# Altium schematic sheet Connectors.SchDoc: Connectors
size A3; Date: Not used; ApprovedBy: Not used; CheckedBy: Not used; Author: Not used; CompanyName: STMicroelectronics; DrawnBy: Not used; Engineer: Not used; Organization: Not used; Address1: Not used; Address2: Not used; Address3: Not used; Address4: Not used; DocumentNumber: 5; Revision: Not used; SheetNumber: 5; SheetTotal: 9; CurrentTime: Not used; CurrentDate: Not used; Time: Not used; DocumentFullPathAndName: Not used; DocumentName: Not used; ModifiedDate: Not used; ImagePath: Not used; ProjectName: Not used; Application_BuildNumber: Not used
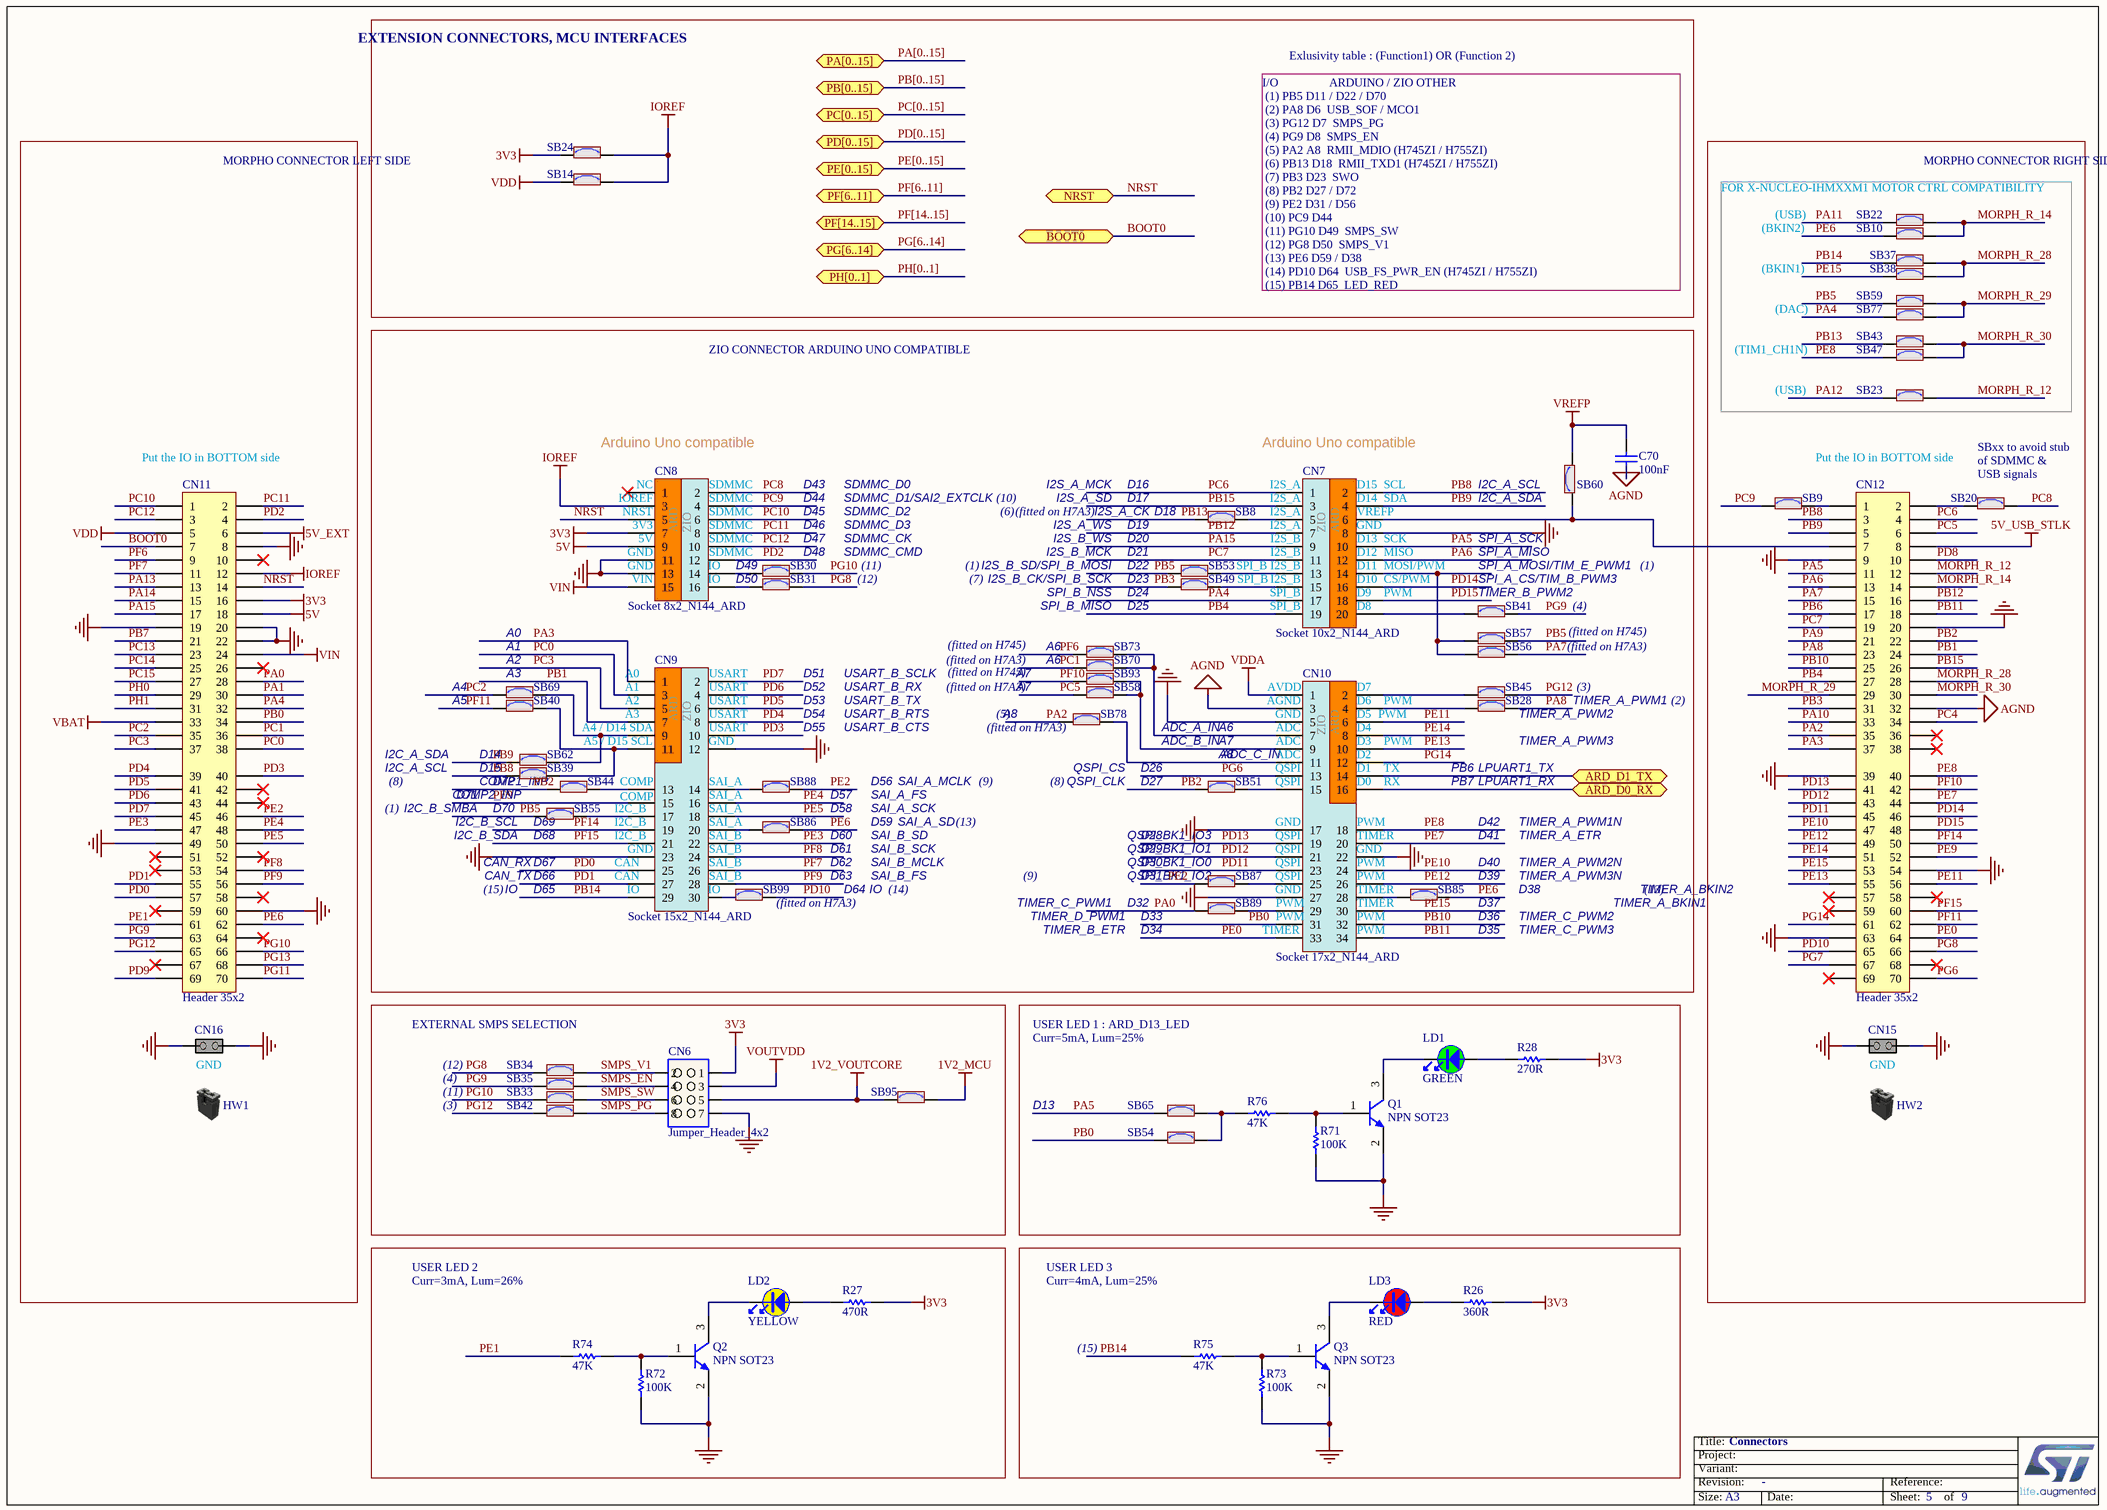
[diagram p0: Connectors.SchDoc]

## Parts
C70  value 100nF  [C0603]  (hidden comment: Capacitor)
CN6  value Jumper_Header_4x2  [CON_SAMTEC_TSW-104-07-X-D]  (hidden comment: Jumper_Header 4x2)
CN7  Socket 10x2_N144_ARD  [CON_SAMTEC_SSW-110-23-X-D_N144_ARD]
CN8  Socket 8x2_N144_ARD  [CON_SAMTEC_SSW-108-23-X-D_N144_ARD]
CN9  Socket 15x2_N144_ARD  [CON_SAMTEC_SSW-115-23-X-D_N144_ARD]
CN10  Socket 17x2_N144_ARD  [CON_SAMTEC_SSW-117-23-X-D_N144_ARD]
CN11  Header 35x2  [CON_SAMTEC_TSW-135-07-X-D]
CN12  Header 35x2  [CON_SAMTEC_TSW-135-07-X-D]
CN15  Jumper_Header 2x1  [CON_SAMTEC_TSW-102-09-X-S]  (value not drawn)
CN16  Jumper_Header 2x1  [CON_SAMTEC_TSW-102-09-X-S]  (value not drawn)
HW1  Shunt Black 2.54mm  (value not drawn)  (mechanical)
HW2  Shunt Black 2.54mm  (value not drawn)  (mechanical)
LD1  value GREEN  [LED_0603_OSRAM_LG-Q396-PS-35_GREEN_1A2K_H0P4]  (hidden comment: LED_green)
LD2  value YELLOW  [LED_0603_OSRAM_LY-Q396-P1Q2-36_YELLOW_1A2K_H0P4]  (hidden comment: LED_yellow)
LD3  value RED  [LED_0603_OSRAM_LS-Q976-NR-1_RED_1A2K_H0P8]  (hidden comment: LED_red)
Q1  value NPN SOT23  [NPN_SOT23]  (hidden comment: 9013-SOT23)
Q2  value NPN SOT23  [NPN_SOT23]  (hidden comment: 9013-SOT23)
Q3  value NPN SOT23  [NPN_SOT23]  (hidden comment: 9013-SOT23)
R26  value 360R  [R0603]  (hidden comment: Resistor)
R27  value 470R  [R0603]  (hidden comment: Resistor)
R28  value 270R  [R0402]  (hidden comment: Resistor)
R71  value 100K  [R0603]  (hidden comment: Resistor)
R72  value 100K  [R0603]  (hidden comment: Resistor)
R73  value 100K  [R0603]  (hidden comment: Resistor)
R74  value 47K  [R0603]  (hidden comment: Resistor)
R75  value 47K  [R0603]  (hidden comment: Resistor)
R76  value 47K  [R0603]  (hidden comment: Resistor)
SB8  SB_ON  [SOLDER-BRIDGE_R0603-0R]  (value not drawn)
SB9  SB_ON  [SOLDER-BRIDGE_R0603-0R]  (value not drawn)
SB10  SB_ON  [SOLDER-BRIDGE_R0603-0R]  (value not drawn)
SB14  SB_ON  [SOLDER-BRIDGE_R0402-0R]  (value not drawn)
SB20  SB_ON  [SOLDER-BRIDGE_R0603-0R]  (value not drawn)
SB22  SB_ON  [SOLDER-BRIDGE_R0603-0R]  (value not drawn)
SB23  SB_ON  [SOLDER-BRIDGE_R0603-0R]  (value not drawn)
SB24  SB_ON  [SOLDER-BRIDGE_R0402-0R]  (value not drawn)
SB28  SB_ON  [SOLDER-BRIDGE_R0603-0R]  (value not drawn)
SB30  SB_ON  [SOLDER-BRIDGE_R0603-0R]  (value not drawn)
SB31  SB_ON  [SOLDER-BRIDGE_R0603-0R]  (value not drawn)
SB33  SB_ON  [SOLDER-BRIDGE_R0603-0R]  (value not drawn)
SB34  SB_ON  [SOLDER-BRIDGE_R0603-0R]  (value not drawn)
SB35  SB_ON  [SOLDER-BRIDGE_R0603-0R]  (value not drawn)
SB37  SB_ON  [SOLDER-BRIDGE_R0402-0R]  (value not drawn)
SB38  SB_ON  [SOLDER-BRIDGE_R0402-0R]  (value not drawn)
SB39  SB_ON  [SOLDER-BRIDGE_R0603-0R]  (value not drawn)
SB40  SB_ON  [SOLDER-BRIDGE_R0603-0R]  (value not drawn)
SB41  SB_ON  [SOLDER-BRIDGE_R0603-0R]  (value not drawn)
SB42  SB_ON  [SOLDER-BRIDGE_R0603-0R]  (value not drawn)
SB43  SB_ON  [SOLDER-BRIDGE_R0603-0R]  (value not drawn)
SB44  SB_ON  [SOLDER-BRIDGE_R0603-0R]  (value not drawn)
SB45  SB_ON  [SOLDER-BRIDGE_R0603-0R]  (value not drawn)
SB47  SB_ON  [SOLDER-BRIDGE_R0603-0R]  (value not drawn)
SB49  SB_ON  [SOLDER-BRIDGE_R0603-0R]  (value not drawn)
SB51  SB_ON  [SOLDER-BRIDGE_R0603-0R]  (value not drawn)
SB53  SB_ON  [SOLDER-BRIDGE_R0603-0R]  (value not drawn)
SB54  SB_ON  [SOLDER-BRIDGE_R0603-0R]  (value not drawn)
SB55  SB_ON  [SOLDER-BRIDGE_R0603-0R]  (value not drawn)
SB56  SB_ON  [SOLDER-BRIDGE_R0603-0R]  (value not drawn)
SB57  SB_ON  [SOLDER-BRIDGE_R0603-0R]  (value not drawn)
SB58  SB_ON  [SOLDER-BRIDGE_R0603-0R]  (value not drawn)
SB59  SB_ON  [SOLDER-BRIDGE_R0603-0R]  (value not drawn)
SB60  SB_ON  [SOLDER-BRIDGE_R0603-0R]  (value not drawn)
SB62  SB_ON  [SOLDER-BRIDGE_R0603-0R]  (value not drawn)
SB65  SB_ON  [SOLDER-BRIDGE_R0603-0R]  (value not drawn)
SB69  SB_ON  [SOLDER-BRIDGE_R0603-0R]  (value not drawn)
SB70  SB_ON  [SOLDER-BRIDGE_R0603-0R]  (value not drawn)
SB73  SB_ON  [SOLDER-BRIDGE_R0603-0R]  (value not drawn)
SB77  SB_ON  [SOLDER-BRIDGE_R0603-0R]  (value not drawn)
SB78  SB_ON  [SOLDER-BRIDGE_R0603-0R]  (value not drawn)
SB85  SB_ON  [SOLDER-BRIDGE_R0603-0R]  (value not drawn)
SB86  SB_ON  [SOLDER-BRIDGE_R0603-0R]  (value not drawn)
SB87  SB_ON  [SOLDER-BRIDGE_R0603-0R]  (value not drawn)
SB88  SB_ON  [SOLDER-BRIDGE_R0603-0R]  (value not drawn)
SB89  SB_ON  [SOLDER-BRIDGE_R0603-0R]  (value not drawn)
SB93  SB_ON  [SOLDER-BRIDGE_R0603-0R]  (value not drawn)
SB95  SB_ON  [SOLDER-BRIDGE_R0603-0R]  (value not drawn)
SB99  SB_ON  [SOLDER-BRIDGE_R0603-0R]  (value not drawn)

## Ports
ARD_D0_RX (bidir), ARD_D1_TX (bidir), BOOT0, NRST, PA[0..15] (bidir), PB[0..15] (bidir), PC[0..15] (bidir), PD[0..15] (bidir), PE[0..15] (bidir), PF[6..11] (bidir), PF[14..15] (bidir), PG[6..14] (bidir), PH[0..1] (bidir)

## Nets
1V2_MCU: SB95.2
1V2_VOUTCORE: CN6.5 SB95.1
3V3: CN6.1 CN8.7 CN11.16 R26.2 R27.2 R28.2 SB24.1
5V: CN8.9 CN11.18
5V_EXT: CN11.6
5V_USB_STLK: CN12.8
AGND: C70.1 CN10.3 CN12.32
GND: CN6.7 CN7.8 CN8.11 CN8.13 CN9.12 CN9.23 CN10.5 CN10.17 CN10.22 CN10.27 CN11.8 CN11.19 CN11.20 CN11.22 CN11.49 CN11.60 CN12.9 CN12.20 CN12.39 CN12.54 CN12.63 CN15.1(COMMON) CN15.2(NO) CN16.1(COMMON) CN16.2(NO) Q1.2(E) Q2.2(E) Q3.2(E) R71.1 R72.1 R73.1
IOREF: CN8.3 CN11.12 SB14.2 SB24.2
VBAT: CN11.33
VDD: CN11.5 SB14.1
VDDA: CN10.1
VIN: CN8.15 CN11.24
VOUTVDD: CN6.3
VREFP: C70.2 SB60.2
ARD_D0_RX: CN10.16 ; port ARD_D0_RX
ARD_D1_TX: CN10.14 ; port ARD_D1_TX
BOOT0: CN11.7 ; port BOOT0
MORPH_R_12: CN12.12 SB23.2
MORPH_R_14: CN12.14 SB10.2 SB22.2
MORPH_R_28: CN12.28 SB37.2 SB38.2
MORPH_R_29: CN12.29 SB59.2 SB77.2
MORPH_R_30: CN12.30 SB43.2 SB47.2
NRST: CN8.5 CN11.14 ; port NRST
PA0: CN11.28 SB89.1
PA1: CN11.30
PA2: CN12.35 SB78.1
PA3: CN9.1 CN12.37
PA4: CN7.17 CN11.32 SB77.1
PA5: CN7.10 CN12.11 SB65.1
PA6: CN7.12 CN12.13
PA7: CN12.15 SB56.2
PA8: CN12.23 SB28.2
PA9: CN12.21
PA10: CN12.33
PA11: SB22.1
PA12: SB23.1
PA13: CN11.13
PA14: CN11.15
PA15: CN7.9 CN11.17
PB0: CN10.31 CN11.34 SB54.1
PB1: CN9.7 CN12.24
PB2: CN12.22 SB44.1 SB51.1
PB3: CN12.31 SB49.1
PB4: CN7.19 CN12.27
PB5: SB53.1 SB55.1 SB57.2 SB59.1
PB6: CN12.17
PB7: CN11.21
PB8: CN7.2 CN12.3 SB39.1
PB9: CN7.4 CN12.5 SB62.1
PB10: CN10.32 CN12.25
PB11: CN10.34 CN12.18
PB12: CN7.7 CN12.16
PB13: SB8.1 SB43.1
PB14: CN9.29 R75.1 SB37.1
PB15: CN7.3 CN12.26
PC0: CN9.3 CN11.38
PC1: CN11.36 SB70.1
PC2: CN11.35 SB69.1
PC3: CN9.5 CN11.37
PC4: CN12.34
PC5: CN12.6 SB58.1
PC6: CN7.1 CN12.4
PC7: CN7.11 CN12.19
PC8: CN8.2 SB20.2
PC9: CN8.4 SB9.1
PC10: CN8.6 CN11.1
PC11: CN8.8 CN11.2
PC12: CN8.10 CN11.3
PC13: CN11.23
PC14: CN11.25
PC15: CN11.27
PD0: CN9.25 CN11.57
PD1: CN9.27 CN11.55
PD2: CN8.12 CN11.4
PD3: CN9.10 CN11.40
PD4: CN9.8 CN11.39
PD5: CN9.6 CN11.41
PD6: CN9.4 CN11.43
PD7: CN9.2 CN11.45
PD8: CN12.10
PD9: CN11.69
PD10: CN12.65 SB99.2
PD11: CN10.23 CN12.45
PD12: CN10.21 CN12.43
PD13: CN10.19 CN12.41
PD14: CN7.16 CN12.46
PD15: CN7.18 CN12.48
PE0: CN10.33 CN12.64
PE1: CN11.61 R74.1
PE2: CN11.46 SB87.1 SB88.2
PE3: CN9.22 CN11.47
PE4: CN9.16 CN11.48
PE5: CN9.18 CN11.50
PE6: CN11.62 SB10.1 SB85.2 SB86.2
PE7: CN10.20 CN12.44
PE8: CN10.18 CN12.40 SB47.1
PE9: CN9.15 CN12.52
PE10: CN10.24 CN12.47
PE11: CN10.6 CN12.56
PE12: CN10.26 CN12.49
PE13: CN10.10 CN12.55
PE14: CN10.8 CN12.51
PE15: CN10.30 CN12.53 SB38.1
PF6: CN11.9 SB73.1
PF7: CN9.26 CN11.11
PF8: CN9.24 CN11.54
PF9: CN9.28 CN11.56
PF10: CN12.42 SB93.1
PF11: CN12.62 SB40.1
PF14: CN9.19 CN12.50
PF15: CN9.21 CN12.60
PG6: CN10.13 CN12.70
PG7: CN12.67
PG8: CN12.66 SB31.2 SB34.2
PG9: CN11.63 SB35.2 SB41.2
PG10: CN11.66 SB30.2 SB33.2
PG11: CN11.70
PG12: CN11.65 SB42.2 SB45.2
PG13: CN11.68
PG14: CN10.12 CN12.61
PH0: CN11.29
PH1: CN11.31
SMPS_EN: CN6.4 SB35.1
SMPS_PG: CN6.8 SB42.1
SMPS_SW: CN6.6 SB33.1
SMPS_V1: CN6.2 SB34.1
NetCN7_5: CN7.5 SB8.2
NetCN7_6: CN7.6 CN12.7 SB60.1
NetCN7_13: CN7.13 SB53.2
NetCN7_14: CN7.14 SB56.1 SB57.1
NetCN7_15: CN7.15 SB49.2
NetCN7_20: CN7.20 SB41.1
NetCN8_14: CN8.14 SB30.1
NetCN8_16: CN8.16 SB31.1
NetCN9_9: CN9.9 SB62.2 SB69.2
NetCN9_11: CN9.11 SB39.2 SB40.2
NetCN9_13: CN9.13 SB44.2
NetCN9_14: CN9.14 SB88.1
NetCN9_17: CN9.17 SB55.2
NetCN9_20: CN9.20 SB86.1
NetCN9_30: CN9.30 SB99.1
NetCN10_2: CN10.2 SB45.1
NetCN10_4: CN10.4 SB28.1
NetCN10_7: CN10.7 SB70.2 SB73.2
NetCN10_9: CN10.9 SB58.2 SB93.2
NetCN10_11: CN10.11 SB78.2
NetCN10_15: CN10.15 SB51.2
NetCN10_25: CN10.25 SB87.2
NetCN10_28: CN10.28 SB85.1
NetCN10_29: CN10.29 SB89.2
NetCN12_1: CN12.1 SB9.2
NetCN12_2: CN12.2 SB20.1
NetLD1_1: LD1.1 R28.1
NetLD1_2: LD1.2 Q1.3(C)
NetLD2_1: LD2.1 R27.1
NetLD2_2: LD2.2 Q2.3(C)
NetLD3_1: LD3.1 R26.1
NetLD3_2: LD3.2 Q3.3(C)
NetQ1_1: Q1.1(B) R71.2 R76.2
NetQ2_1: Q2.1(B) R72.2 R74.2
NetQ3_1: Q3.1(B) R73.2 R75.2
NetR76_1: R76.1 SB54.2 SB65.2

Not connected (* = marked no-connect by the designer): CN8 1*; CN11 10* 26* 42* 44* 51* 52* 53* 58* 59* 64* 67*; CN12 36* 38* 57* 58* 59* 68* 69*

## Buses and harness runs
bus PA[0..15] = port PA[0..15]
bus PB[0..15] = port PB[0..15]
bus PC[0..15] = port PC[0..15]
bus PD[0..15] = port PD[0..15]
bus PE[0..15] = port PE[0..15]
bus PF[6..11] = port PF[6..11]
bus PF[14..15] = port PF[14..15]
bus PG[6..14] = port PG[6..14]
bus PH[0..1] = port PH[0..1]

## Notes on the sheet
- EXTENSION CONNECTORS, MCU INTERFACES
- Exlusivity table : (Function1) OR (Function 2)
- MORPHO CONNECTOR LEFT SIDE
- MORPHO CONNECTOR RIGHT SIDE
- FOR X-NUCLEO-IHMXXM1 MOTOR CTRL COMPATIBILITY
- (BKIN2)
- (USB)
- I/O	                ARDUINO / ZIO	OTHER
  (1)	PB5	D11 / D22 / D70
  (2)	PA8	D6		USB_SOF / MCO1
  (3)	PG12	D7		SMPS_PG
  (4)	PG9	D8		SMPS_EN
  (5)	PA2	A8		RMII_MDIO (H745ZI / H755ZI)
  (6)	PB13	D18		RMII_TXD1 (H745ZI / H755ZI)
  (7)	PB3	D23		SWO
  (8)	PB2	D27 / D72
  (9)	PE2	D31 / D56
  (10)	PC9	D44
  (11)	PG10	D49		SMPS_SW
  (12)	PG8	D50		SMPS_V1
  (13)	PE6	D59 / D38
  (14)	PD10	D64		USB_FS_PWR_EN (H745ZI / H755ZI)
  (15)	PB14	D65		LED_RED
- (BKIN1)
- (DAC)
- ZIO CONNECTOR ARDUINO UNO COMPATIBLE
- (TIM1_CH1N)
- (near CN8) Arduino Uno compatible
- (near CN7) Arduino Uno compatible
- (near CN11) Put the IO in BOTTOM side
- (near CN8) NC
- (near CN8) IOREF
- (near CN8) NRST
- (near CN8) SDMMC
- D43
- D44
- D45
- SDMMC_D0
- SDMMC_D1/SAI2_EXTCLK
- SDMMC_D2
- (10)
- (6)
- (fitted on H7A3)
- I2S_A_SD
- I2S_A_MCK
- D16
- D17
- I2S_A_CK
- D18
- (near CN7) I2S_A
- (near CN7) VREFP
- (near CN7) D14
- (near CN7) D15
- (near CN7) SCL
- (near CN7) SDA
- (near SB60) I2C_A_SCL
- (near SB60) I2C_A_SDA
- Put the IO in BOTTOM side
- (near SB20) SBxx to avoid stub of SDMMC & USB signals
- (near CN8) 3V3
- (near CN8) 5V
- (near CN8) GND
- (near CN8) VIN
- (near CN8) IO
- D49
- D50
- D46
- D47
- D48
- SDMMC_CK
- SDMMC_CMD
- SDMMC_D3
- (12)
- (11)
- (1)
- (7)
- I2S_A_WS
- I2S_B_SD/SPI_B_MOSI
- I2S_B_CK/SPI_B_SCK
- I2S_B_WS
- I2S_B_MCK
- D19
- D20
- D21
- D22
- D23
- SPI_B
- (near CN7) I2S_B
- (near CN7) D10
- (near CN7) D11
- (near CN7) D12
- (near CN7) D13
- (near CN7) SCK
- (near CN7) GND
- (near CN7) MISO
- (near CN7) MOSI/PWM
- (near CN7) CS/PWM
- (near SB41) SPI_A_CS/TIM_B_PWM3
- (near SB41) SPI_A_MOSI/TIM_E_PWM1
- SPI_A_SCK
- SPI_A_MISO
- A0
- A1
- (fitted on H745)
- A6
- SPI_B_MISO
- SPI_B_NSS
- D24
- D25
- (near CN7) SPI_B
- (near CN7) D8
- (near CN7) D9
- (near CN7) PWM
- (near SB41) TIMER_B_PWM2
- (4)
- A4
- A5
- A2
- (near SB69) A3
- (near CN9) A0
- (near CN9) A1
- (near CN9) A2
- (near CN9) A3
- (near CN9) USART
- D51
- D52
- D53
- D54
- USART_B_TX
- USART_B_RX
- USART_B_SCLK
- USART_B_RTS
- (5)
- A8
- A7
- (near CN10) GND
- (near CN10) AVDD
- (near CN10) AGND
- (near CN10) D7
- (near CN10) D6
- (near CN10) D5
- (near CN10) PWM
- TIMER_A_PWM2
- TIMER_A_PWM1
- (3)
- (2)
- I2C_A_SCL
- I2C_A_SDA
- (8)
- COMP1_INP
- D14
- D15
- D72
- (near CN9) COMP
- (near CN9) A4 / D14 SDA
- (near CN9) A5 / D15 SCL
- (near CN9) SAI_A
- (near CN9) GND
- D55
- USART_B_CTS
- D56
- SAI_A_MCLK
- (9)
- (near SB78) (fitted on H7A3)
- QSPI_CLK
- (near SB78) QSPI_CS
- D26
- D27
- ADC_A_IN
- (near SB51) ADC_B_IN
- (near SB51) ADC_C_IN
- (near SB51) A8
- (near CN10) ADC
- (near CN10) QSPI
- (near CN10) D2
- (near CN10) D4
- (near CN10) D3
- (near CN10) D1
- (near CN10) D0
- (near CN10) TX
- (near CN10) RX
- PB6
- PB7
- LPUART1_TX
- LPUART1_RX
- TIMER_A_PWM3
- COMP2_INP
- D71
- I2C_B_SMBA
- D70
- I2C_B_SCL
- (near SB55) I2C_B_SDA
- (near SB55) D69
- (near SB55) D68
- (near CN9) I2C_B
- (near CN9) SAI_B
- D57
- D58
- D60
- D61
- SAI_A_SCK
- SAI_A_FS
- SAI_B_SD
- SAI_B_SCK
- D59
- SAI_A_SD
- (13)
- QSPI_BK1_IO1
- QSPI_BK1_IO3
- D28
- D29
- (near CN10) TIMER
- D41
- D42
- TIMER_A_PWM1N
- TIMER_A_ETR
- (15)
- IO
- CAN_TX
- (near SB55) CAN_RX
- (near SB55) D67
- D66
- D65
- (near CN9) CAN
- (near CN9) IO
- (near SB99) (fitted on H7A3)
- D62
- D63
- D64
- SAI_B_FS
- SAI_B_MCLK
- (14)
- TIMER_C_PWM1
- TIMER_D_PWM1
- QSPI_BK1_IO0
- QSPI_BK1_IO2
- D32
- D30
- D31
- D33
- (near SB85) D36
- (near SB85) D37
- (near SB85) D39
- (near SB85) D40
- TIMER_A_PWM2N
- TIMER_A_PWM3N
- TIMER_C_PWM2
- D38
- TIMER_A_BKIN1
- TIMER_A_BKIN2
- TIMER_B_ETR
- D34
- (near SB85) D35
- TIMER_C_PWM3
- EXTERNAL SMPS SELECTION
- USER LED 1 : ARD_D13_LED
- Curr=5mA, Lum=25%
- GND
- D13
- USER LED 2
- Curr=3mA, Lum=26%
- USER LED 3
- Curr=4mA, Lum=25%
- Title:
- Project:
- Size:
- Revision:
- Variant:
- -
- Date:
- Reference:
- Sheet:
- of
- (in symbol MCD-01037) ARD; ZIO
- (in symbol MCD-01039) ZIO; ARD
- (in symbol MCD-01040) ARD; ZIO
- (in symbol MCD-01041) ZIO; ARD

## Library data of the parts
C70 = MCD-00237: Capacitor, MLCC, 100nF, 6V3, X5R, 10%, 0603, T=0,8mm; Manufacturer_Part_Number: CC0603KRX5R5BB104; Manufacturer: YAGEO; Provided_By: SUBCO; ECCN_US: EAR99; ECCN_EU: NEC; Internal_Part_Number: MCD-00237; Status: Released; Part_Type: Capacitor; Package: C0603; ComponentLink1Description: Datasheet; ComponentLink1URL: http://tunmcdsvn.tun.st.com/Component_Datasheet_Library/Trunk/Capacitors/Yageo_Multilayer_capacitor_X5R_series_100pF_to_100uF
CN6 = MCD-00633: Header, 4x2, 2,54mm, VR, TH, Height 5.84mm/2.54mm; Part_Type: Connector; Manufacturer_Part_Number: TSW-104-07-x-D; Manufacturer: SAMTEC; Provided_By: SUBCO; Internal_Part_Number: MCD-00633; Status: Released; ComponentLink1Description: Datasheet; ComponentLink1URL: http://tunmcdsvn.tun.st.com/Component_Datasheet_Library/Trunk/Connectors/Samtec_TSW-HTSW-series; ECCN_US: n/a; ECCN_EU: n/a
CN7 = MCD-01039: Socket, 10x2, 2.54mm, VR, TH, Height 8.51mm/10mm, Low insertion force.; Part_Type: Connector; Manufacturer_Part_Number: SSW-110-23-x-D; Manufacturer: SAMTEC; Provided_By: SUBCO; Internal_Part_Number: MCD-01039; Value: Socket 10x2_N144_ARD; Status: Released; ComponentLink1Description: Datasheet; ComponentLink1URL: http://tunmcdsvn.tun.st.com/Component_Datasheet_Library/Trunk/Connectors/Samtec_SSW-SSQ-series; ECCN_US: n/a; ECCN_EU: n/a
CN8 = MCD-01037: Socket, 8x2, 2.54mm, VR, TH, Height 8.51mm/10mm, Low insertion force.; Part_Type: Connector; Manufacturer_Part_Number: SSW-108-23-x-D; Manufacturer: SAMTEC; Provided_By: SUBCO; Internal_Part_Number: MCD-01037; Value: Socket 8x2_N144_ARD; Status: Released; ComponentLink1Description: Datasheet; ComponentLink1URL: http://tunmcdsvn.tun.st.com/Component_Datasheet_Library/Trunk/Connectors/Samtec_SSW-SSQ-series; ECCN_US: n/a; ECCN_EU: n/a
CN9 = MCD-01040: Socket, 15x2, 2.54mm, VR, TH, Height 8.51mm/10mm, Low insertion force.; Part_Type: Connector; Manufacturer_Part_Number: SSW-115-23-x-D; Manufacturer: SAMTEC; Provided_By: SUBCO; Internal_Part_Number: MCD-01040; Value: Socket 15x2_N144_ARD; Status: Released; ComponentLink1Description: Datasheet; ComponentLink1URL: http://tunmcdsvn.tun.st.com/Component_Datasheet_Library/Trunk/Connectors/Samtec_SSW-SSQ-series; ECCN_US: n/a; ECCN_EU: n/a
CN10 = MCD-01041: Socket, 17x2, 2.54mm, VR, TH, Height 8.51mm/10mm, Low insertion force; Part_Type: Connector; Manufacturer_Part_Number: SSW-117-23-x-D; Manufacturer: SAMTEC; Provided_By: SUBCO; Internal_Part_Number: MCD-01041; Value: Socket 17x2_N144_ARD; Status: Released; ComponentLink1Description: Datasheet; ComponentLink1URL: http://tunmcdsvn.tun.st.com/Component_Datasheet_Library/Trunk/Connectors/Samtec_SSW-SSQ-series; ECCN_US: n/a; ECCN_EU: n/a
CN11 CN12 = MCD-01210: Header, 35x2, 2,54mm, VR, TH, Height 5.84mm/2.54mm; Part_Type: Connector; Manufacturer_Part_Number: TSW-135-07-x-D; Manufacturer: SAMTEC; Provided_By: SUBCO; Internal_Part_Number: MCD-01210; Value: Header 35x2; Status: Released; ComponentLink1Description: Datasheet; ComponentLink1URL: http://tunmcdsvn.tun.st.com/Component_Datasheet_Library/Trunk/Connectors/Samtec_TSW-HTSW-series; ECCN_US: n/a; ECCN_EU: n/a
CN15 CN16 = MCD-00214: Header, 2x1, 2,54mm, VR, TH, Height 5.84mm/10.16mm; Manufacturer_Part_Number: TSW-102-09-x-S; Manufacturer: SAMTEC; Part_Type: Connector; Value: Header 2x1 16mm; Provided_By: SUBCO; Internal_Part_Number: MCD-00214; ComponentLink1Description: Datasheet; Status: Released; ComponentLink1URL: http://tunmcdsvn.tun.st.com/Component_Datasheet_Library/Trunk/Connectors/Samtec_TSW-HTSW-series; ECCN_US: n/a; ECCN_EU: n/a
HW1 HW2 = MCD-00043: SHUNT 2.54mm BLACK; Manufacturer_Part_Number: SNT-100-BK-G; Manufacturer: SAMTEC; Part_Type: Mechanical; Alternate_Manufacturer_Part_Number: 316102S111A; Alternate_Manufacturer: JIUBABA; Provided_By: SUBCO; Internal_Part_Number: MCD-00043; ComponentLink1Description: Datasheet; Status: Released; ComponentLink1URL: http://tunmcdsvn.tun.st.com/Component_Datasheet_Library/Trunk/Connectors/Samtec_Shunt_Jumper_SNT100; ECCN_US: n/a; ECCN_EU: n/a
LD1 = MCD-00588: LED Green, 0603 SMD, Forward Voltage Typ=2V, Max=2.5V; Part_Type: Display; Manufacturer_Part_Number: LG Q396-PS-35; Manufacturer: OSRAM OPTO SEMICONDUCTORS; Alternate_Manufacturer_Part_Number: VLMTG1300-GS08; Alternate_Manufacturer: VISHAY SEMICONDUCTOR OPTO DIVISION; Provided_By: SUBCO; Internal_Part_Number: MCD-00588; Status: Released; Package: LED 0603; ComponentLink1Description: Datasheet; ComponentLink1URL: http://tunmcdsvn.tun.st.com/Component_Datasheet_Library/Trunk/Display/OSRAM_LED_GREEN_LG Q396-PS-35; Order_Code_Digikey: LG Q396-PS-35-ND; ECCN_US: n/a; ECCN_EU: n/a
LD2 = MCD-01061: LED Yellow, 0603 SMD, Forward Voltage min=1.7V, Typ=2V, Max=2.3V; Part_Type: Display; Manufacturer_Part_Number: LY Q396-P1Q2-36; Manufacturer: OSRAM OPTO SEMICONDUCTORS; Provided_By: SUBCO; Internal_Part_Number: MCD-01061; Status: Released; ComponentLink1Description: Datasheet; ComponentLink1URL: http://tunmcdsvn.tun.st.com/Component_Datasheet_Library/Trunk/Display/OSRAM_LED_0603_YELLOW_LY Q396-P1Q2-36; ECCN_US: n/a; ECCN_EU: n/a
LD3 = MCD-00586: LED Red, 0603 SMD, Forward Voltage Typ=2V, Max=2.5V; Part_Type: Display; Manufacturer_Part_Number: LS Q976-NR-1; Manufacturer: OSRAM OPTO SEMICONDUCTORS; Alternate_Manufacturer_Part_Number: VLMS1300-GS08; Alternate_Manufacturer: VISHAY SEMICONDUCTOR OPTO DIVISION; Provided_By: SUBCO; Internal_Part_Number: MCD-00586; Status: Released; Package: LED 0603; ComponentLink1Description: Datasheet; ComponentLink1URL: http://tunmcdsvn.tun.st.com/Component_Datasheet_Library/Trunk/Display/OSRAM_LED_RED_LS Q976-NR-1; Order_Code_Digikey: 475-2512-1-ND; ECCN_US: n/a; ECCN_EU: n/a
Q1-Q3 = MCD-00073: NPN Bipolar Transistor; Part_Type: IC; Manufacturer_Part_Number: BSR14; Manufacturer: ON SEMICONDUCTOR; Alternate_Manufacturer_Part_Number: MMBT2222LT1G / MMBT2222ALT1G / MMBT2222ALT3G; Provided_By: SUBCO; ECCN_US: EAR99; ECCN_EU: NEC; Revision: *; Internal_Part_Number: MCD-00073; Status: Released; ComponentLink1Description: Datasheet; ComponentLink1URL: http://tunmcdsvn.tun.st.com/Component_Datasheet_Library/Trunk/IC/NXP_Transistor_BSR14; Alternate_Manufacturer: ON SEMICONDUCTOR; Package: SOT23
R26 = MCD-00462: Resistor,360R,0603,1%,1/10W; Manufacturer_Part_Number: RC0603FR-07360RL; Manufacturer: YAGEO; BMS_Part_Number: 9129744; Provided_By: SUBCO; ECCN_US: EAR99; ECCN_EU: NEC; Internal_Part_Number: MCD-00462; Status: Released; Part_Type: Resistor; Package: R0603; ComponentLink1Description: Datasheet; ComponentLink1URL: http://tunmcdsvn.tun.st.com/Component_Datasheet_Library/Trunk/Resistors/Yageo_Resistor_RC0603-series
R27 = MCD-00354: Resistor,470R,0603,1%,1/10W; Manufacturer_Part_Number: RC0603FR-07470RL; Manufacturer: YAGEO; BMS_Part_Number: 9129906; Provided_By: SUBCO; ECCN_US: EAR99; ECCN_EU: NEC; Internal_Part_Number: MCD-00354; Status: Released; Part_Type: Resistor; Package: R0603; ComponentLink1Description: Datasheet; ComponentLink1URL: http://tunmcdsvn.tun.st.com/Component_Datasheet_Library/Trunk/Resistors/Yageo_Resistor_RC0603-series
R28 = MCD-00441: Resistor,270R,0402,1%,1/16W; Manufacturer_Part_Number: RC0402FR-07270RL; Manufacturer: YAGEO; Provided_By: SUBCO; ECCN_US: EAR99; ECCN_EU: NEC; Internal_Part_Number: MCD-00441; Status: Released; Part_Type: Resistor; Package: R0402; ComponentLink1Description: Datasheet; ComponentLink1URL: http://tunmcdsvn.tun.st.com/Component_Datasheet_Library/Trunk/Resistors/Yageo_Resistor_RC0402-series
R71-R73 = MCD-00223: Resistor,100K,0603,1%,1/10W; Manufacturer_Part_Number: RC0603FR-07100KL; Manufacturer: YAGEO; Provided_By: SUBCO; ECCN_US: EAR99; ECCN_EU: NEC; Internal_Part_Number: MCD-00223; Status: Released; Part_Type: Resistor; ComponentLink1Description: Datasheet; Package: R0603; ComponentLink1URL: http://tunmcdsvn.tun.st.com/Component_Datasheet_Library/Trunk/Resistors/Yageo_Resistor_RC0603-series
R74-R76 = MCD-00222: Resistor,47K,0603,1%,1/10W; Manufacturer_Part_Number: RC0603FR-0747KL; Manufacturer: YAGEO; Provided_By: SUBCO; ECCN_US: EAR99; ECCN_EU: NEC; Internal_Part_Number: MCD-00222; Status: Released; Part_Type: Resistor; ComponentLink1Description: Datasheet; Package: R0603; ComponentLink1URL: http://tunmcdsvn.tun.st.com/Component_Datasheet_Library/Trunk/Resistors/Yageo_Resistor_RC0603-series
SB8-SB10 SB20 SB22 SB23 SB28 SB30 SB31 SB33-SB35 SB39-SB45 SB47 SB49 SB51 SB53-SB60 SB62 SB65 SB69 SB70 SB73 SB77 SB78 SB85-SB89 SB93 SB95 SB99 = MCD-00071: Solder Bridge ON; Part_Type: Mechanical; Manufacturer_Part_Number: RC0603JR-070RL; Manufacturer: YAGEO; Provided_By: SUBCO; Internal_Part_Number: MCD-00071; Status: Released; ComponentLink1Description: Datasheet; Package: SB0603; ComponentLink1URL: http://tunmcdsvn.tun.st.com/Component_Datasheet_Library/Trunk/Resistors/Yageo_Resistor_RC0603-series; ECCN_US: n/a; ECCN_EU: n/a
SB14 SB24 SB37 SB38 = MCD-01618: Solder Bridge 0402 ON; Part_Type: Mechanical; Manufacturer_Part_Number: RC0402JR-070RL; Manufacturer: YAGEO; Provided_By: SUBCO; Internal_Part_Number: MCD-01618; Status: Footprint available; Package: SB0402; ComponentLink1Description: Datasheet; ComponentLink1URL: http://tunmcdsvn.tun.st.com/Component_Datasheet_Library/Trunk/Resistors/Yageo_Resistor_RC0402-series; ECCN_US: n/a; ECCN_EU: n/a